# EAGLE schematic Principal (EAGLE 9.2.2)
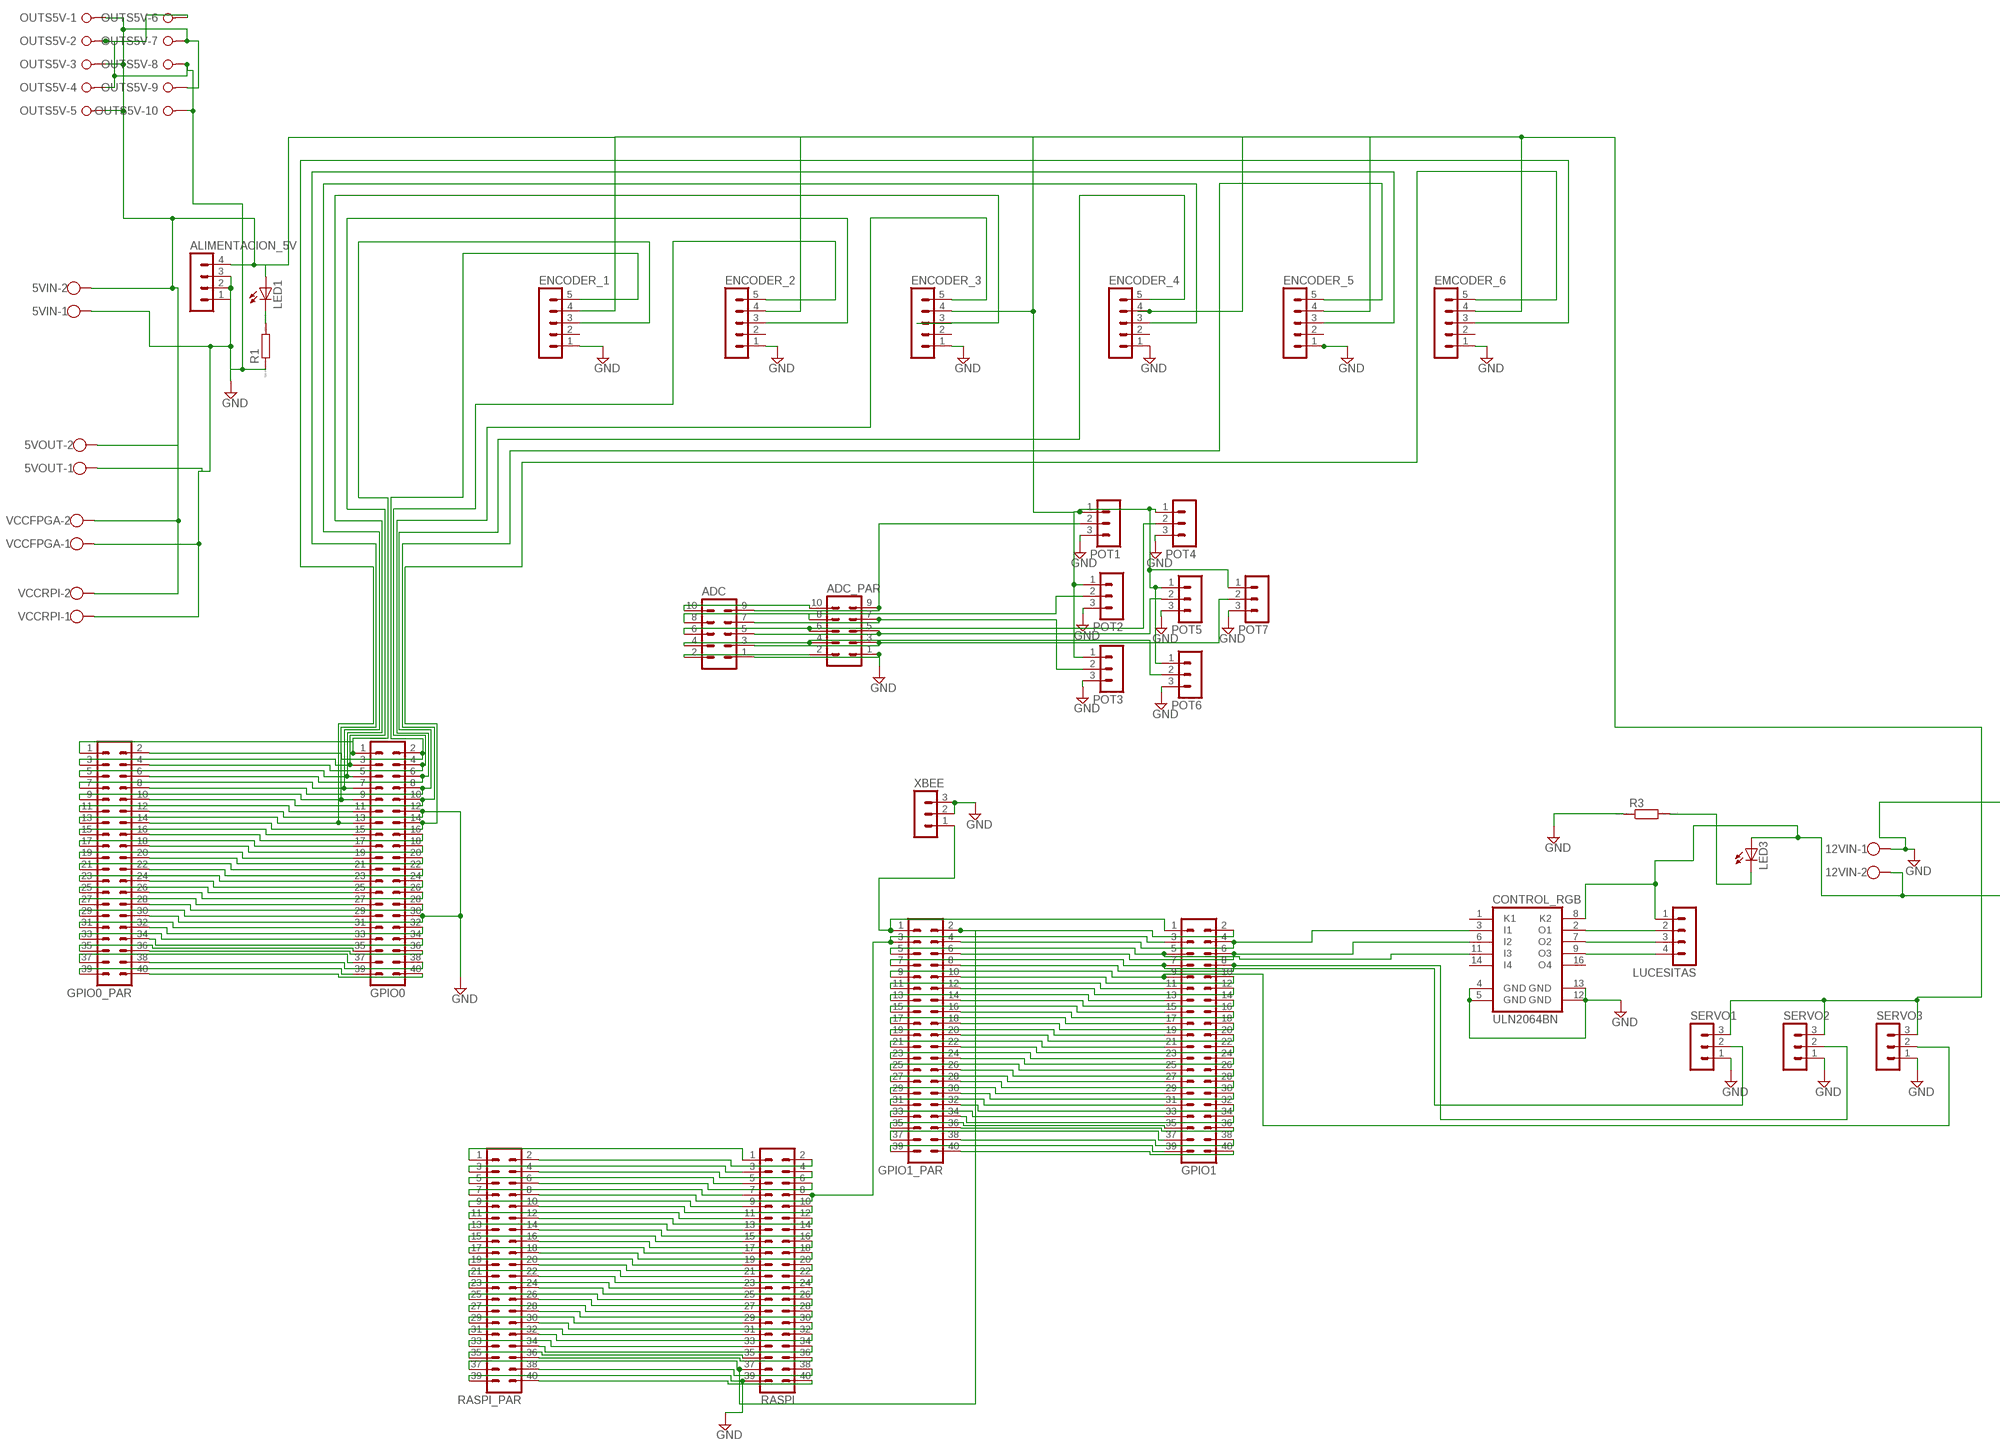
[diagram p0: schematic, sheet 1, part 1 of 2]
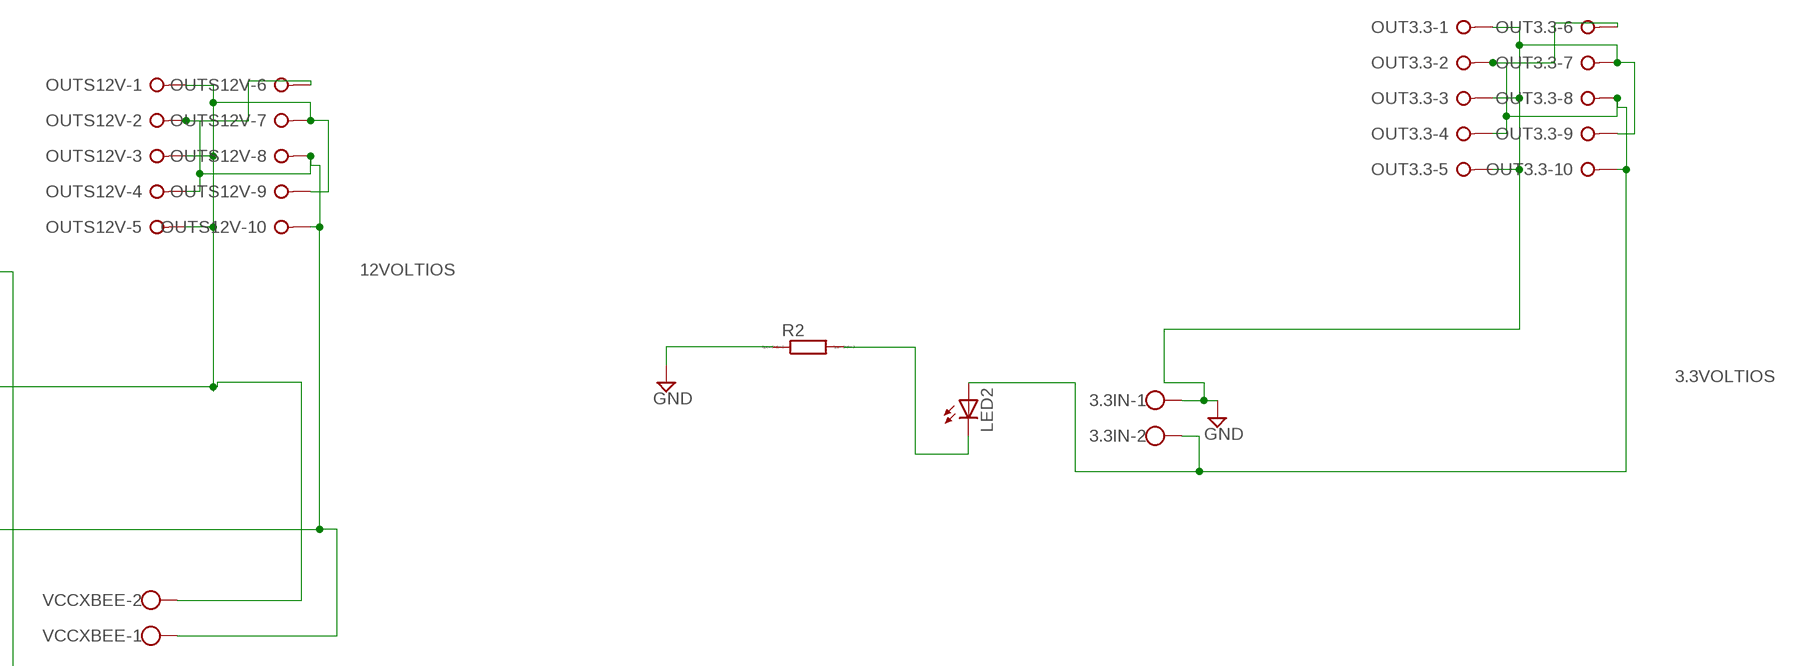
[diagram p1: schematic, sheet 1, part 2 of 2]

## Parts
3.3IN  W237-102  [W237-102]
5VIN  W237-102  [W237-102]
5VOUT  W237-102  [W237-102]
12VIN  W237-102  [W237-102]
ADC  MA05-2  [MA05-2]
ADC_PAR  MA05-2  [MA05-2]
ALIMENTACION_5V  MA04-1  [MA04-1]
CONTROL_RGB  ULN2064BN  [DIL16]
EMCODER_6  MA05-1  [MA05-1]
ENCODER_1  MA05-1  [MA05-1]
ENCODER_2  MA05-1  [MA05-1]
ENCODER_3  MA05-1  [MA05-1]
ENCODER_4  MA05-1  [MA05-1]
ENCODER_5  MA05-1  [MA05-1]
GPIO0  MA20-2  [MA20-2]
GPIO0_PAR  MA20-2  [MA20-2]
GPIO1  MA20-2  [MA20-2]
GPIO1_PAR  MA20-2  [MA20-2]
LED1  LEDSML0805  [SML0805]
LED2  LEDSML0805  [SML0805]
LED3  LEDSML0805  [SML0805]
LUCESITAS  MA04-1  [MA04-1]
OUT3.3  W237-10P  [W237-10P]
OUTS5V  W237-10P  [W237-10P]
OUTS12V  W237-10P  [W237-10P]
POT1  MA03-1  [MA03-1]
POT2  MA03-1  [MA03-1]
POT3  MA03-1  [MA03-1]
POT4  MA03-1  [MA03-1]
POT5  MA03-1  [MA03-1]
POT6  MA03-1  [MA03-1]
POT7  MA03-1  [MA03-1]
R1  RR1206  [R1206]
R2  RR1206  [R1206]
R3  RR1206  [R1206]
RASPI  MA20-2  [MA20-2]
RASPI_PAR  MA20-2  [MA20-2]
SERVO1  MA03-1  [MA03-1]
SERVO2  MA03-1  [MA03-1]
SERVO3  MA03-1  [MA03-1]
VCCFPGA  W237-102  [W237-102]
VCCRPI  W237-102  [W237-102]
VCCXBEE  W237-102  [W237-102]
XBEE  MA03-1  [MA03-1]

## Nets
3.3VOLTIOS: 3.3IN.2 LED2.A OUT3.3.2 OUT3.3.4 OUT3.3.6 OUT3.3.8 OUT3.3.10
12VOLTIOS: 12VIN.2 CONTROL_RGB.8(K2) LED3.A LUCESITAS.1 OUTS12V.2 OUTS12V.4 OUTS12V.6 OUTS12V.8 OUTS12V.10 VCCXBEE.1
+5V3: 5VIN.2 5VOUT.2 ALIMENTACION_5V.4 EMCODER_6.4 ENCODER_1.4 ENCODER_2.4 ENCODER_3.4 ENCODER_4.4 ENCODER_5.4 LED1.A OUTS5V.1 OUTS5V.3 OUTS5V.5 OUTS5V.7 OUTS5V.9 POT1.1 POT2.1 POT3.1 POT4.1 POT5.1 POT6.1 POT7.1 SERVO1.3 SERVO2.3 SERVO3.3 VCCFPGA.2 VCCRPI.2
GND: 3.3IN.1 5VIN.1 5VOUT.1 12VIN.1 ADC.1 ADC_PAR.1 ALIMENTACION_5V.1 ALIMENTACION_5V.2 ALIMENTACION_5V.3 CONTROL_RGB.4(GND) CONTROL_RGB.5(GND) CONTROL_RGB.12(GND) CONTROL_RGB.13(GND) EMCODER_6.1 ENCODER_1.1 ENCODER_2.1 ENCODER_3.1 ENCODER_4.1 ENCODER_5.1 GPIO0.12 GPIO0.30 GPIO0_PAR.12 GPIO0_PAR.30 OUT3.3.1 OUT3.3.3 OUT3.3.5 OUT3.3.7 OUT3.3.9 OUTS5V.2 OUTS5V.4 OUTS5V.6 OUTS5V.8 OUTS5V.10 OUTS12V.1 OUTS12V.3 OUTS12V.5 OUTS12V.7 OUTS12V.9 POT1.3 POT2.3 POT3.3 POT4.3 POT5.3 POT6.3 POT7.3 R1.1 R2.1 R3.1 RASPI.39 RASPI_PAR.39 SERVO1.1 SERVO2.1 SERVO3.1 VCCFPGA.1 VCCRPI.1 VCCXBEE.2 XBEE.2 XBEE.3
N$1: LED2.C R2.2
N$4: ENCODER_2.5 GPIO0.4 GPIO0_PAR.4
N$8: ENCODER_4.5 GPIO0.8 GPIO0_PAR.8
N$9: ENCODER_5.3 GPIO0.9 GPIO0_PAR.9
N$11: GPIO0.11 GPIO0_PAR.11
N$14: EMCODER_6.5 GPIO0.14 GPIO0_PAR.14
N$15: GPIO0.15 GPIO0_PAR.15
N$16: GPIO0.16 GPIO0_PAR.16
N$17: GPIO0.17 GPIO0_PAR.17
N$18: GPIO0.18 GPIO0_PAR.18
N$19: GPIO0.19 GPIO0_PAR.19
N$20: GPIO0.20 GPIO0_PAR.20
N$21: GPIO0.21 GPIO0_PAR.21
N$22: GPIO0.22 GPIO0_PAR.22
N$23: GPIO0.23 GPIO0_PAR.23
N$24: GPIO0.24 GPIO0_PAR.24
N$25: GPIO0.25 GPIO0_PAR.25
N$26: GPIO0.26 GPIO0_PAR.26
N$27: GPIO0.27 GPIO0_PAR.27
N$28: GPIO0.28 GPIO0_PAR.28
N$29: GPIO0.29 GPIO0_PAR.29
N$31: GPIO0.31 GPIO0_PAR.31
N$32: GPIO0.32 GPIO0_PAR.32
N$33: GPIO0.33 GPIO0_PAR.33
N$34: GPIO0.34 GPIO0_PAR.34
N$35: GPIO0.35 GPIO0_PAR.35
N$36: GPIO0.36 GPIO0_PAR.36
N$37: GPIO0.37 GPIO0_PAR.37
N$38: GPIO0.38 GPIO0_PAR.38
N$39: GPIO0.39 GPIO0_PAR.39
N$40: GPIO0.40 GPIO0_PAR.40
N$41: GPIO1.1 GPIO1_PAR.1 XBEE.1
N$42: GPIO1.2 GPIO1_PAR.2 RASPI.37 RASPI_PAR.37
N$44: CONTROL_RGB.3(I1) GPIO1.4 GPIO1_PAR.4
N$45: CONTROL_RGB.11(I3) GPIO1.5 GPIO1_PAR.5
N$46: CONTROL_RGB.6(I2) GPIO1.6 GPIO1_PAR.6
N$47: GPIO1.7 GPIO1_PAR.7 SERVO1.2
N$48: GPIO1.8 GPIO1_PAR.8 SERVO2.2
N$49: GPIO1.9 GPIO1_PAR.9 SERVO3.2
N$50: GPIO1.10 GPIO1_PAR.10
N$51: GPIO1.11 GPIO1_PAR.11
N$52: GPIO1.12 GPIO1_PAR.12
N$53: GPIO1.13 GPIO1_PAR.13
N$54: GPIO1.14 GPIO1_PAR.14
N$55: GPIO1.15 GPIO1_PAR.15
N$56: GPIO1.16 GPIO1_PAR.16
N$57: GPIO1.17 GPIO1_PAR.17
N$58: GPIO1.18 GPIO1_PAR.18
N$59: GPIO1.19 GPIO1_PAR.19
N$60: GPIO1.20 GPIO1_PAR.20
N$61: GPIO1.21 GPIO1_PAR.21
N$62: GPIO1.22 GPIO1_PAR.22
N$63: GPIO1.23 GPIO1_PAR.23
N$64: GPIO1.24 GPIO1_PAR.24
N$65: GPIO1.25 GPIO1_PAR.25
N$66: GPIO1.26 GPIO1_PAR.26
N$67: GPIO1.27 GPIO1_PAR.27
N$68: GPIO1.28 GPIO1_PAR.28
N$69: GPIO1.29 GPIO1_PAR.29
N$70: GPIO1.30 GPIO1_PAR.30
N$71: GPIO1.31 GPIO1_PAR.31
N$72: GPIO1.32 GPIO1_PAR.32
N$73: GPIO1.33 GPIO1_PAR.33
N$74: GPIO1.34 GPIO1_PAR.34
N$75: GPIO1.35 GPIO1_PAR.35
N$76: GPIO1.36 GPIO1_PAR.36
N$77: GPIO1.37 GPIO1_PAR.37
N$78: GPIO1.38 GPIO1_PAR.38
N$79: GPIO1.39 GPIO1_PAR.39
N$80: GPIO1.40 GPIO1_PAR.40
N$81: RASPI.1 RASPI_PAR.1
N$82: RASPI.2 RASPI_PAR.2
N$83: RASPI.3 RASPI_PAR.3
N$84: RASPI.4 RASPI_PAR.4
N$85: RASPI.5 RASPI_PAR.5
N$86: RASPI.6 RASPI_PAR.6
N$87: RASPI.7 RASPI_PAR.7
N$88: GPIO1.3 GPIO1_PAR.3 RASPI.8 RASPI_PAR.8
N$89: RASPI.9 RASPI_PAR.9
N$90: RASPI.10 RASPI_PAR.10
N$91: RASPI.11 RASPI_PAR.11
N$92: RASPI.12 RASPI_PAR.12
N$93: RASPI.13 RASPI_PAR.13
N$94: RASPI.14 RASPI_PAR.14
N$95: RASPI.15 RASPI_PAR.15
N$96: RASPI.16 RASPI_PAR.16
N$97: RASPI.17 RASPI_PAR.17
N$98: RASPI.18 RASPI_PAR.18
N$99: RASPI.19 RASPI_PAR.19
N$100: RASPI.20 RASPI_PAR.20
N$101: RASPI.21 RASPI_PAR.21
N$102: RASPI.22 RASPI_PAR.22
N$103: RASPI.23 RASPI_PAR.23
N$104: RASPI.24 RASPI_PAR.24
N$105: RASPI.25 RASPI_PAR.25
N$106: RASPI.26 RASPI_PAR.26
N$107: RASPI.27 RASPI_PAR.27
N$108: RASPI.28 RASPI_PAR.28
N$109: RASPI.29 RASPI_PAR.29
N$110: RASPI.30 RASPI_PAR.30
N$111: RASPI.31 RASPI_PAR.31
N$112: RASPI.32 RASPI_PAR.32
N$113: RASPI.33 RASPI_PAR.33
N$114: RASPI.34 RASPI_PAR.34
N$115: RASPI.35 RASPI_PAR.35
N$116: RASPI.36 RASPI_PAR.36
N$118: RASPI.38 RASPI_PAR.38
N$120: RASPI.40 RASPI_PAR.40
N$121: ADC.10 ADC_PAR.10
N$122: ADC.9 ADC_PAR.9 POT1.2
N$123: ADC.8 ADC_PAR.8 POT2.2
N$124: ADC.7 ADC_PAR.7 POT3.2
N$125: ADC.6 ADC_PAR.6 POT4.2
N$126: ADC.5 ADC_PAR.5 POT5.2
N$127: ADC.4 ADC_PAR.4 POT6.2
N$128: ADC.3 ADC_PAR.3 POT7.2
N$129: ADC.2 ADC_PAR.2
N$131: ENCODER_1.3 GPIO0.1 GPIO0_PAR.1
N$132: ENCODER_1.5 GPIO0.2 GPIO0_PAR.2
N$133: ENCODER_2.3 GPIO0.3 GPIO0_PAR.3
N$135: ENCODER_3.3 GPIO0.5 GPIO0_PAR.5
N$136: ENCODER_3.5 GPIO0.6 GPIO0_PAR.6
N$137: ENCODER_4.3 GPIO0.7 GPIO0_PAR.7
N$140: ENCODER_5.5 GPIO0.10 GPIO0_PAR.10
N$141: EMCODER_6.3 GPIO0.13 GPIO0_PAR.13
N$167: LED1.C R1.2
N$172: LED3.C R3.2
N$193: CONTROL_RGB.2(O1) LUCESITAS.2
N$194: CONTROL_RGB.7(O2) LUCESITAS.3
N$195: CONTROL_RGB.9(O3) LUCESITAS.4
Unconnected: CONTROL_RGB.1(K1) CONTROL_RGB.14(I4) CONTROL_RGB.16(O4) EMCODER_6.2 ENCODER_1.2 ENCODER_2.2 ENCODER_3.2 ENCODER_4.2 ENCODER_5.2

## Library data of the parts
3.3IN 5VIN 5VOUT 12VIN VCCFPGA VCCRPI VCCXBEE = con-wago-500:W237-102: WAGO SCREW CLAMP; MPN: 237-102; OC_FARNELL: unknown; OC_NEWARK: 70K9898
ADC ADC_PAR = con-lstb:MA05-2: PIN HEADER; OC_FARNELL: unknown; OC_NEWARK: unknown
ALIMENTACION_5V LUCESITAS = con-lstb:MA04-1: PIN HEADER; OC_FARNELL: unknown; OC_NEWARK: unknown
CONTROL_RGB = uln-udn:ULN2064B: DRIVER ARRAY
EMCODER_6 ENCODER_1-ENCODER_5 = con-lstb:MA05-1: PIN HEADER; OC_FARNELL: unknown; OC_NEWARK: unknown
GPIO0 GPIO0_PAR GPIO1 GPIO1_PAR RASPI RASPI_PAR = con-lstb:MA20-2: PIN HEADER; OC_FARNELL: unknown; OC_NEWARK: unknown
LED1-LED3 = led:LED: LED OSRAM: - CHIPLED LG R971, LG N971, LY N971, LG Q971, LY Q971, LO R971, LY R971 LH N974, LH R974 LS Q976, LO Q976, LY Q976 LO Q996 - Hyper CHIPLED LW Q18S LB Q993, LB Q99A, LB R99A - SideLED LS A670, LO A670, LY A670, LG A670, LP A670 LB A673, LV A673, LT A673, LW A673 LH A674 LY A675 LS A676, LA A676, LO A676, LY A676, LW A676 LS A679, LY A679, LG A679 - Hyper Micro SIDELED® LS Y876, LA Y876, LO Y876, LY Y876 LT Y87S - SmartLED LW L88C, LW L88S LB L89C, LB L89S, LG L890 LS L89K, LO L89K, LY L89K LS L896, LA L896, LO L896, LY L896 - TOPLED LS T670, LO T670, LY T670, LG T670, LP T670 LSG T670, LSP T670, LSY T670, LOP T670, LYG T670 LG T671, LOG T671, LSG T671 LB T673, LV T673, LT T673, LW T673 LH T674 LS T676, LA T676, LO T676, LY T676, LB T676, LH T676, LSB T676, LW T676 LB T67C, LV T67C, LT T67C, LS T67K, LO T67K, LY T67K, LW E67C LS E67B, LA E67B, LO E67B, LY E67B, LB E67C, LV E67C, LT E67C LW T67C LS T679, LY T679, LG T679 LS T770, LO T770, LY T770, LG T770, LP T770 LB T773, LV T773, LT T773, LW T773 LH T774 LS E675, LA E675, LY E675, LS T675 LS T776, LA T776, LO T776, LY T776, LB T776 LHGB T686 LT T68C, LB T68C - Hyper Mini TOPLED® LB M676 - Mini TOPLED Santana® LG M470 LS M47K, LO M47K, LY M47K Source: http://www.osram.convergy.de LUXEON: - LUMILED® LXK2-PW12-R00, LXK2-PW12-S00, LXK2-PW14-U00, LXK2-PW14-V00 LXK2-PM12-R00, LXK2-PM12-S00, LXK2-PM14-U00 LXK2-PE12-Q00, LXK2-PE12-R00, LXK2-PE12-S00, LXK2-PE14-T00, LXK2-PE14-U00 LXK2-PB12-K00, LXK2-PB12-L00, LXK2-PB12-M00, LXK2-PB14-N00, LXK2-PB14-P00, LXK2-PB14-Q00 LXK2-PR12-L00, LXK2-PR12-M00, LXK2-PR14-Q00, LXK2-PR14-R00 LXK2-PD12-Q00, LXK2-PD12-R00, LXK2-PD12-S00 LXK2-PH12-R00, LXK2-PH12-S00 LXK2-PL12-P00, LXK2-PL12-Q00, LXK2-PL12-R00 Source: www.luxeon.com KINGBRIGHT: KA-3528ASYC Source: www.kingbright.com
OUT3.3 OUTS5V OUTS12V = con-wago-508:W237-10P: WAGO SREW CLAMP; OC_FARNELL: unknown; OC_NEWARK: unknown
POT1-POT7 SERVO1-SERVO3 XBEE = con-lstb:MA03-1: PIN HEADER; OC_FARNELL: unknown; OC_NEWARK: unknown
R1-R3 = eagle-ltspice:R: RESISTOR, European symbol; SPICEMODEL: NONE; SPICEPREFIX: R